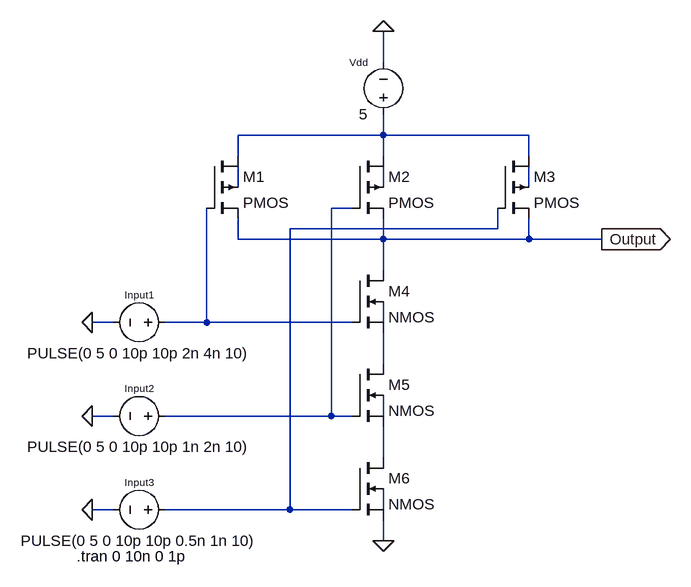
[diagram p0: schematic 3 Input NAND CMOS.asc]
3 Input NAND CMOS.asc, the LTspice schematic file:
Version 4
SHEET 1 880 680
WIRE 288 -192 288 -240
WIRE 288 -80 288 -112
WIRE 288 -80 64 -80
WIRE 512 -80 288 -80
WIRE 64 -48 64 -80
WIRE 288 -48 288 -80
WIRE 512 -48 512 -80
WIRE 64 0 64 -32
WIRE 288 0 288 -32
WIRE 512 0 512 -32
WIRE 240 32 208 32
WIRE 464 64 464 32
WIRE 464 64 144 64
WIRE 64 80 64 48
WIRE 288 80 288 48
WIRE 288 80 64 80
WIRE 512 80 512 48
WIRE 512 80 288 80
WIRE 624 80 512 80
WIRE 288 128 288 80
WIRE -128 208 -160 208
WIRE 16 208 16 32
WIRE 16 208 -48 208
WIRE 240 208 16 208
WIRE 288 208 288 176
WIRE 288 272 288 224
WIRE -128 352 -160 352
WIRE 208 352 208 32
WIRE 208 352 -48 352
WIRE 240 352 208 352
WIRE 288 352 288 320
WIRE 288 416 288 368
WIRE -128 496 -160 496
WIRE 144 496 144 64
WIRE 144 496 -48 496
WIRE 240 496 144 496
WIRE 288 496 288 464
WIRE 288 544 288 512
FLAG 288 -240 0
FLAG 288 544 0
FLAG -160 208 0
FLAG -160 352 0
FLAG -160 496 0
FLAG 624 80 Output
IOPIN 624 80 Out
SYMBOL pmos4 16 -48 R0
SYMATTR InstName M1
SYMATTR Value2 l=0.9u w=1.8u
SYMBOL pmos4 240 -48 R0
SYMATTR InstName M2
SYMATTR Value2 l=0.9u w=1.8u
SYMBOL pmos4 464 -48 R0
SYMATTR InstName M3
SYMATTR Value2 l=0.9u w=1.8u
SYMBOL voltage 288 -96 R180
WINDOW 0 24 96 Left 1
WINDOW 3 24 16 Left 2
WINDOW 123 0 0 Left 0
WINDOW 39 0 0 Left 0
SYMATTR InstName Vdd
SYMATTR Value 5
SYMBOL nmos4 240 128 R0
SYMATTR InstName M4
SYMATTR Value2 l=0.9u w=1.8u
SYMBOL nmos4 240 272 R0
SYMATTR InstName M5
SYMATTR Value2 l=0.9u w=1.8u
SYMBOL nmos4 240 416 R0
SYMATTR InstName M6
SYMATTR Value2 l=0.9u w=1.8u
SYMBOL voltage -32 208 R90
WINDOW 0 -32 56 VBottom 1
WINDOW 3 32 56 VTop 2
WINDOW 123 0 0 Left 0
WINDOW 39 0 0 Left 0
SYMATTR InstName Input1
SYMATTR Value PULSE(0 5 0 10p 10p 2n 4n 10)
SYMBOL voltage -32 352 R90
WINDOW 0 -32 56 VBottom 1
WINDOW 3 32 56 VTop 2
WINDOW 123 0 0 Left 0
WINDOW 39 0 0 Left 0
SYMATTR InstName Input2
SYMATTR Value PULSE(0 5 0 10p 10p 1n 2n 10)
SYMBOL voltage -32 496 R90
WINDOW 0 -32 56 VBottom 1
WINDOW 3 32 56 VTop 2
WINDOW 123 0 0 Left 0
WINDOW 39 0 0 Left 0
SYMATTR InstName Input3
SYMATTR Value PULSE(0 5 0 10p 10p 0.5n 1n 10)
TEXT -184 568 Left 2 !.tran 0 10n 0 1p

The netlist it stands for:
* 3 Input NAND CMOS.asc
M1 N001 N007 Output N002 PMOS l=0.9u w=1.8u
M2 N001 N005 Output N003 PMOS l=0.9u w=1.8u
M3 N001 N006 Output N004 PMOS l=0.9u w=1.8u
Vdd N001 0 5
M4 Output N007 N009 N008 NMOS l=0.9u w=1.8u
M5 N009 N005 N011 N010 NMOS l=0.9u w=1.8u
M6 N011 N006 0 N012 NMOS l=0.9u w=1.8u
V§Input1 N007 0 PULSE(0 5 0 10p 10p 2n 4n 10)
V§Input2 N005 0 PULSE(0 5 0 10p 10p 1n 2n 10)
V§Input3 N006 0 PULSE(0 5 0 10p 10p 0.5n 1n 10)
.model NMOS NMOS
.model PMOS PMOS
.lib standard.mos
.tran 0 10n 0 1p
.backanno
.end